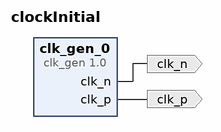
[diagram p0: block diagram of the top level]
# Vivado block design clockInitial, Vivado 2015.1
create_bd_design clockInitial

create_bd_port -dir O clk_p
create_bd_port -dir O clk_n

create_bd_cell -type ip -vlnv xilinx.com:ip:clk_gen:1.0 clk_gen_0
set_property -dict {CONFIG.CLOCK_TYPE Differential CONFIG.FREQ_HZ 200000000} [get_bd_cells clk_gen_0]

# ---- connections ----

connect_bd_net [get_bd_pins clk_gen_0/clk_p] [get_bd_ports clk_p]
connect_bd_net [get_bd_pins clk_gen_0/clk_n] [get_bd_ports clk_n]

validate_bd_design
save_bd_design
